# Altium schematic sheet carrier.SchDoc: Carrier
size A3; Organization: GPA Robotics; DocumentNumber: 2; Revision: REV 0; SheetNumber: 2; SheetTotal: 11
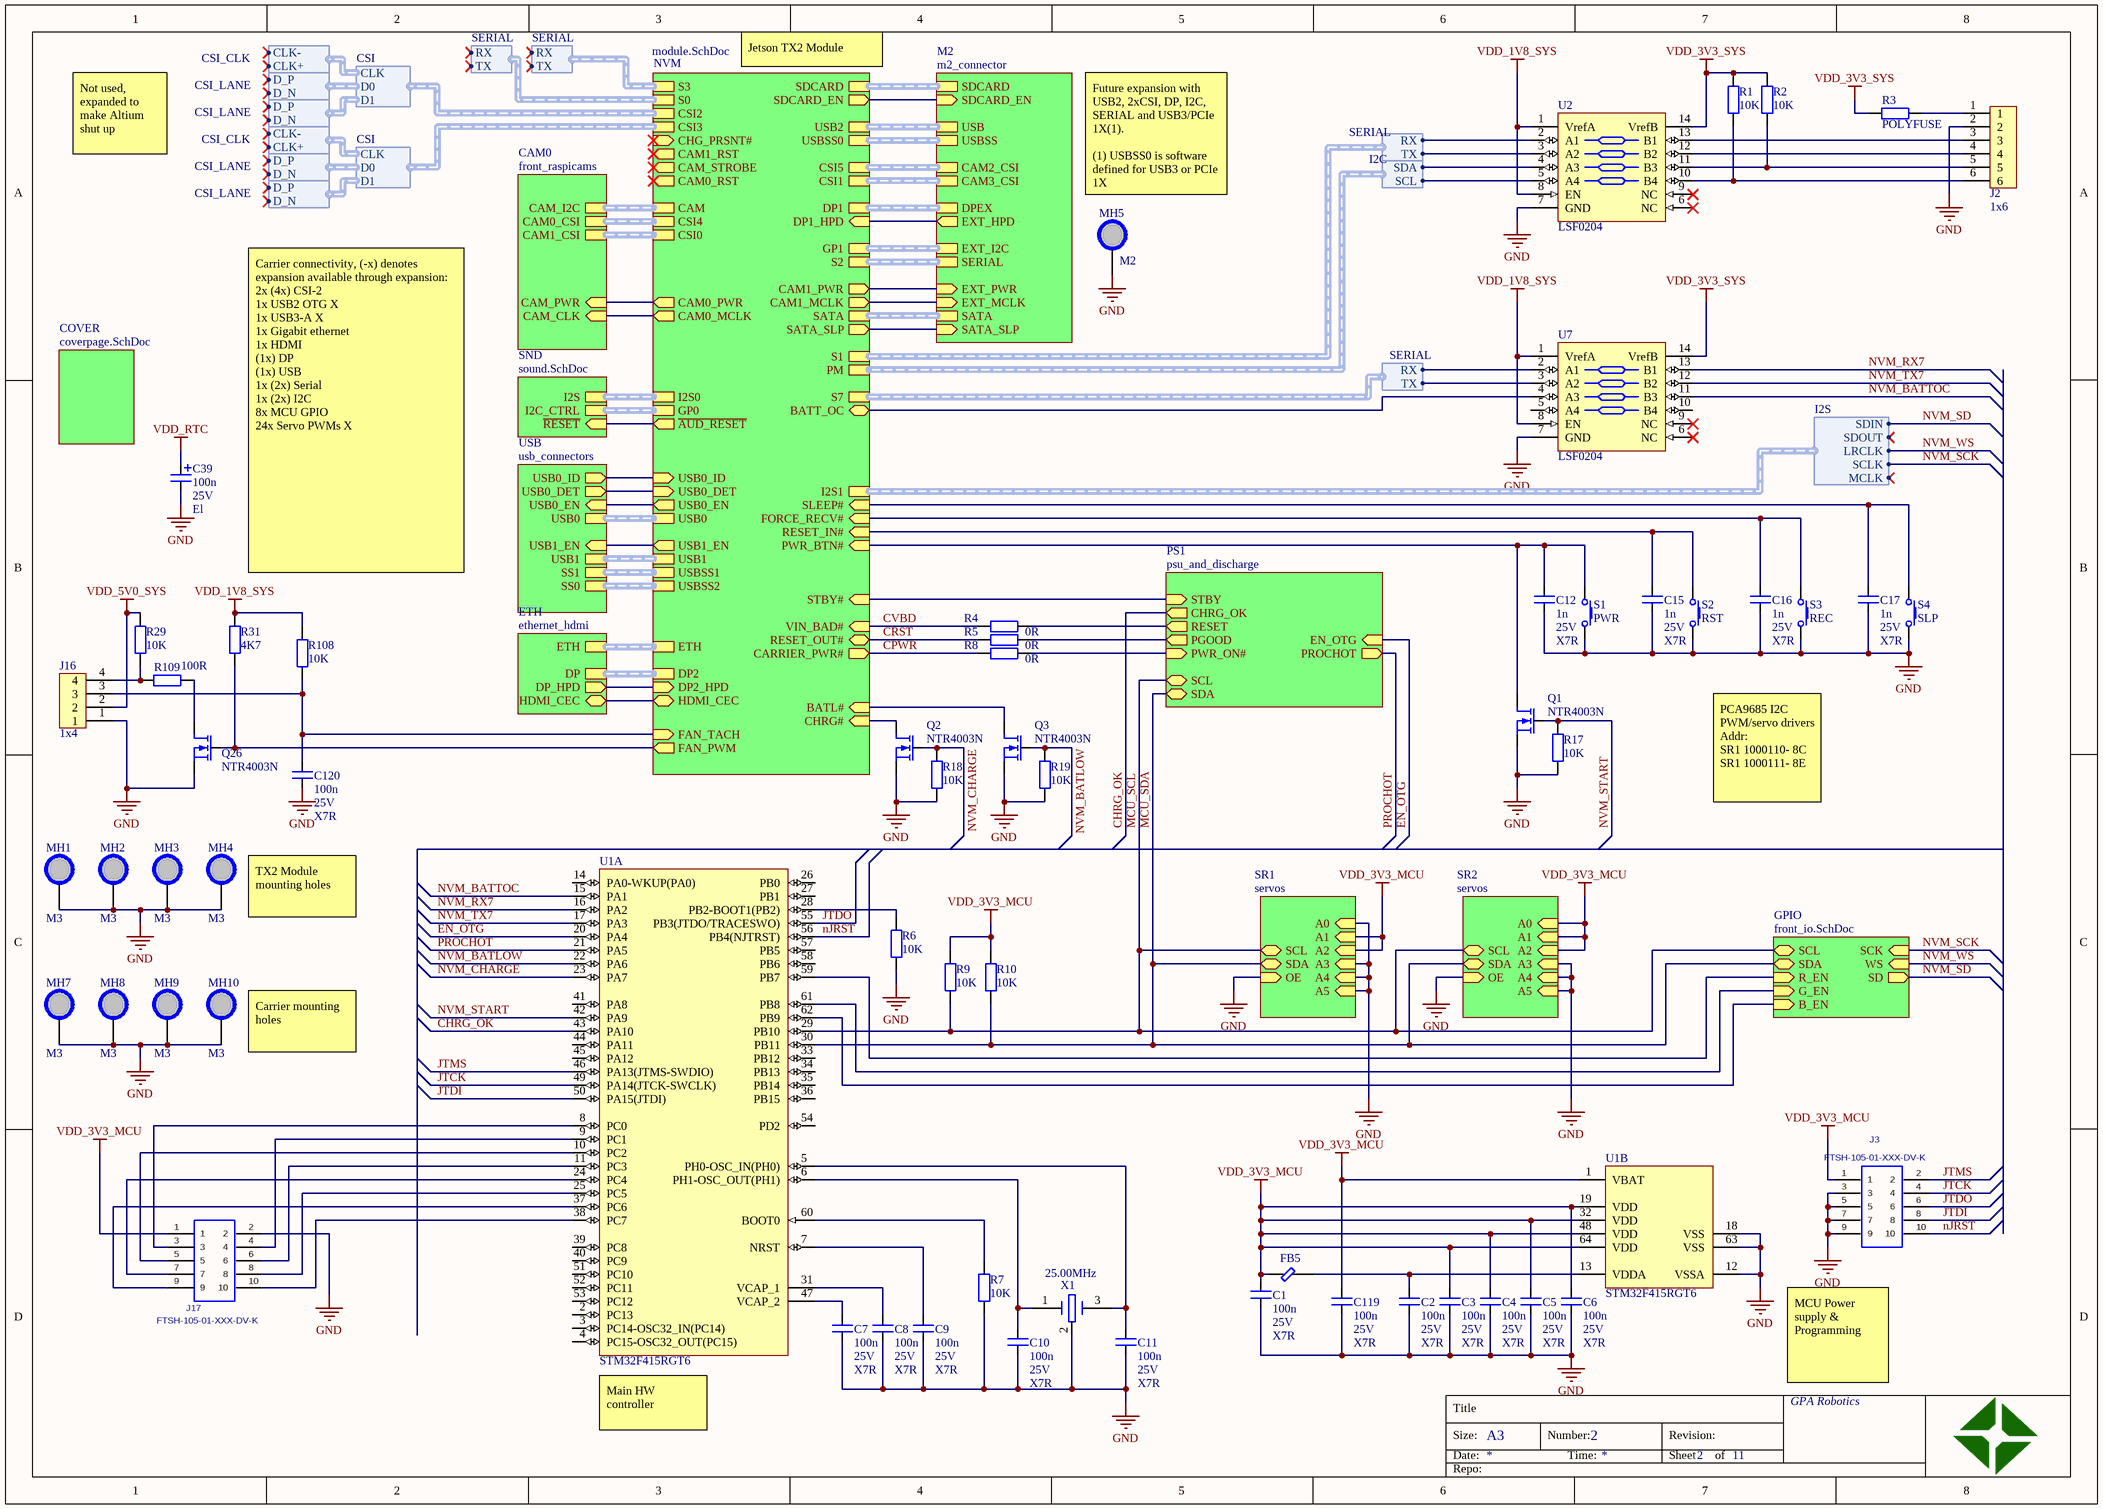
[diagram p0: carrier.SchDoc]

## Parts
C1  value 100n  Voltage: 25V  Type: X7R  [C1005[0402]]  (hidden comment: cap)
C2  value 100n  Voltage: 25V  Type: X7R  [C1005[0402]]  (hidden comment: cap)
C3  value 100n  Voltage: 25V  Type: X7R  [C1005[0402]]  (hidden comment: cap)
C4  value 100n  Voltage: 25V  Type: X7R  [C1005[0402]]  (hidden comment: cap)
C5  value 100n  Voltage: 25V  Type: X7R  [C1005[0402]]  (hidden comment: cap)
C6  value 100n  Voltage: 25V  Type: X7R  [C1005[0402]]  (hidden comment: cap)
C7  value 100n  Voltage: 25V  Type: X7R  [C1005[0402]]  (hidden comment: cap)
C8  value 100n  Voltage: 25V  Type: X7R  [C1005[0402]]  (hidden comment: cap)
C9  value 100n  Voltage: 25V  Type: X7R  [C1005[0402]]  (hidden comment: cap)
C10  value 100n  Voltage: 25V  Type: X7R  [C1005[0402]]  (hidden comment: cap)
C11  value 100n  Voltage: 25V  Type: X7R  [C1005[0402]]  (hidden comment: cap)
C12  value 1n  Voltage: 25V  Type: X7R  [C1005[0402]]  (hidden comment: cap)
C15  value 1n  Voltage: 25V  Type: X7R  [C1005[0402]]  (hidden comment: cap)
C16  value 1n  Voltage: 25V  Type: X7R  [C1005[0402]]  (hidden comment: cap)
C17  value 1n  Voltage: 25V  Type: X7R  [C1005[0402]]  (hidden comment: cap)
C39  value 100n  Voltage: 25V  Type: El  [SC_DSK-3R3H224U-HL]  (hidden comment: pcap)
C119  value 100n  Voltage: 25V  Type: X7R  [C1005[0402]]  (hidden comment: cap)
C120  value 100n  Voltage: 25V  Type: X7R  [C1005[0402]]  (hidden comment: cap)
FB5  2506036007Y3  [FBC1608X07N]  (value not drawn)
J2  1x6  [hdr_100mil_1x6]
J3  FTSH-105-01-XXX-DV-K  [FTSH-105-01-XXX-DV-K]
J16  1x4  [molex_picoblade_1x4]
J17  FTSH-105-01-XXX-DV-K  [FTSH-105-01-XXX-DV-K]
MH1  M3  [m3_pan_tight_round]
MH2  M3  [m3_pan_tight_round]
MH3  M3  [m3_pan_tight_round]
MH4  M3  [m3_pan_tight_round]
MH5  M2  [m2_pan_tight_round]
MH7  M3  [m3_pan_tight_round]
MH8  M3  [m3_pan_tight_round]
MH9  M3  [m3_pan_tight_round]
MH10  M3  [m3_pan_tight_round]
Q1  NTR4003N  [NCH_SOT95P237X110-3N]
Q2  NTR4003N  [NCH_SOT95P237X110-3N]
Q3  NTR4003N  [NCH_SOT95P237X110-3N]
Q26  NTR4003N  [NCH_SOT95P237X110-3N]
R1  value 10K  [R1005[0402]]  (hidden comment: res)
R2  value 10K  [R1005[0402]]  (hidden comment: res)
R3  value POLYFUSE  [R1005[0402]]  (hidden comment: res)
R4  value 0R  [R1005[0402]]  (hidden comment: res)
R5  value 0R  [R1005[0402]]  (hidden comment: res)
R6  value 10K  [R1005[0402]]  (hidden comment: res)
R7  value 10K  [R1005[0402]]  (hidden comment: res)
R8  value 0R  [R1005[0402]]  (hidden comment: res)
R9  value 10K  [R1005[0402]]  (hidden comment: res)
R10  value 10K  [R1005[0402]]  (hidden comment: res)
R17  value 10K  [R1005[0402]]  (hidden comment: res)
R18  value 10K  [R1005[0402]]  (hidden comment: res)
R19  value 10K  [R1005[0402]]  (hidden comment: res)
R29  value 10K  [R1005[0402]]  (hidden comment: res)
R31  value 4K7  [R1005[0402]]  (hidden comment: res)
R108  value 10K  [R1005[0402]]  (hidden comment: res)
R109  value 100R  [R1005[0402]]  (hidden comment: res)
S1  PWR  [SW_6MM_TACT]
S2  RST  [SW_6MM_TACT]
S3  REC  [SW_6MM_TACT]
S4  SLP  [SW_6MM_TACT]
U1  STM32F415RGT6  [STM-LQFP64_N]  (parts A,B of 2)
U2  LSF0204  [TI_TSOP65P640X120-14N]
U7  LSF0204  [TI_TSOP65P640X120-14N]
X1  value 25.00MHz  [FA-238]  (hidden comment: crystal_shielded)

## Sub-sheets
CAM0 = front_raspicams: CAM0_CSI (harness CSI), CAM_I2C (harness I2C), CAM_CLK (in), CAM_PWR (in), CAM1_CSI (harness CSI)
COVER = coverpage.SchDoc: no entries
ETH = ethernet_hdmi: ETH (harness GBE), DP (harness DP), DP_HPD (out), HDMI_CEC (bidir)
GPIO = front_io.SchDoc: SCL (bidir), SDA (bidir), WS (in), SCK (in), R_EN (in), G_EN (in), SD (out), B_EN (in)
M2 = m2_connector: SDCARD_EN (in), SDCARD (harness SDCARD), USB (harness USB2), USBSS (harness USB3), CAM2_CSI (harness CSI), CAM3_CSI (harness CSI), DPEX (harness DP), EXT_HPD (out), EXT_I2C (harness I2C), SERIAL (harness SERIAL), EXT_PWR (in), EXT_MCLK (in), SATA_SLP (in), SATA (harness SATA)
NVM = module.SchDoc: CHRG# (in), CSI5 (harness CSI), CSI0 (harness CSI), CSI4 (harness CSI), USB0 (harness USB2), CAM (harness I2C), USB0_ID (in), CSI3 (harness CSI), BATL# (in), PM (harness I2C), CSI2 (harness CSI), STBY# (in), CSI1 (harness CSI), GP1 (harness I2C), CAM_STROBE (out), SDCARD (harness SDCARD), CAM1_MCLK (out), CAM0_MCLK (out), S7 (harness SERIAL), CAM0_PWR (out), GP0 (harness I2C), SDCARD_EN (out), USB0_EN (out), PWR_BTN# (in), S3 (harness SERIAL), S2 (harness SERIAL), S1 (harness SERIAL), SLEEP# (in), CAM0_RST (out), CAM1_PWR (out), S0 (harness SERIAL), FORCE_RECV# (in), CAM1_RST (out), USB1_EN (out), USB0_DET (in), USBSS0 (harness USB3), CHG_PRSNT# (in), CARRIER_PWR# (out), RESET_IN# (in), USBSS2 (harness USB3), USBSS1 (harness USB3), VIN_BAD# (in), USB1 (harness USB2), RESET_OUT# (bidir), ETH (harness GBE), USB2 (harness USB2), DP1 (harness DP), DP1_HPD (in), DP2 (harness DP), DP2_HPD (in), I2S0 (harness I2S), BATT_OC (bidir), ~{AUD_RESET} (out), SATA (harness SATA), SATA_SLP (out), I2S1 (harness I2S), FAN_PWM (out), FAN_TACH (in), HDMI_CEC (bidir)
PS1 = psu_and_discharge: SCL (bidir), PWR_ON# (in), PGOOD (out), SDA (bidir), RESET (out), EN_OTG (in), PROCHOT (out), CHRG_OK (out), STBY (in)
SND = sound.SchDoc: ~{RESET} (in), I2S (harness I2S), I2C_CTRL (harness I2C)
SR1 = servos: SDA (bidir), SCL (bidir), OE (in), A1 (in), A2 (in), A3 (in), A0 (in), A4 (in), A5 (in)
SR2 = servos: SDA (bidir), SCL (bidir), OE (in), A1 (in), A2 (in), A3 (in), A0 (in), A4 (in), A5 (in)
USB = usb_connectors: USB0 (harness USB2), USB1 (harness USB2), SS1 (harness USB3), USB0_DET (out), USB0_EN (in), USB0_ID (out), USB1_EN (in), SS0 (harness USB3)

## Harnesses
SERIAL: RX, TX
I2C: SDA, SCL
I2S: SDIN, SDOUT, LRCLK, SCLK, MCLK
CSI: CLK, D0, D1
CSI_CLK: CLK-, CLK+
CSI_LANE: D_P, D_N

## Nets
GND: C1.2 C2.2 C3.2 C4.2 C5.2 C6.2 C7.2 C8.2 C9.2 C10.2 C11.2 C12.1 C15.1 C16.1 C17.1 C39.2 C119.2 C120.1 J2.2 J3.3 J3.5 J3.7 J3.9 J16.1 J17.2 MH1.1 MH2.1 MH3.1 MH4.1 MH5.1 MH7.1 MH8.1 MH9.1 MH10.1 Q1.S Q2.S Q3.S Q26.S R6.1 R7.1 R17.1 R18.1 R19.1 S1.2 S2.2 S3.2 S4.2 U1.12(VSSA) U1.18(VSS) U1.63(VSS) U2.7(GND) U7.7(GND) X1.2 ; sheet SR1/OE, sheet SR1/A3, sheet SR1/A0, sheet SR1/A4, sheet SR1/A5, sheet SR2/OE, sheet SR2/A3, sheet SR2/A4, sheet SR2/A5
VDD_1V8_SYS: R31.2 R108.2 U2.1(VrefA) U2.8(EN) U7.1(VrefA) U7.8(EN)
VDD_3V3_MCU: C1.1 C3.1 C4.1 C5.1 C6.1 C119.1 FB5.1 J3.1 J17.1 R9.2 R10.2 U1.1(VBAT) U1.19(VDD) U1.32(VDD) U1.48(VDD) U1.64(VDD) ; sheet SR1/A1, sheet SR1/A2, sheet SR2/A1, sheet SR2/A2, sheet SR2/A0
VDD_3V3_SYS: R1.2 R2.2 R3.2 U2.14(VrefB) U7.14(VrefB)
VDD_5V0_SYS: J16.2 R29.1
VDD_RTC: C39.1
CHRG_OK: U1.43(PA10) ; sheet PS1/CHRG_OK
CPWR: R8.1 ; sheet NVM/CARRIER_PWR#
CRST: R5.1 ; sheet NVM/RESET_OUT#
CVBD: R4.1 ; sheet NVM/VIN_BAD#
EN_OTG: U1.20(PA4) ; sheet PS1/EN_OTG
JTCK: J3.4 U1.49(PA14(JTCK-SWCLK))
JTDI: J3.8 U1.50(PA15(JTDI))
JTDO: J3.6 U1.55(PB3(JTDO/TRACESWO))
JTMS: J3.2 U1.46(PA13(JTMS-SWDIO))
MCU_SCL: R9.1 U1.29(PB10) ; sheet SR1/SCL, sheet SR2/SCL, sheet PS1/SCL, sheet GPIO/SCL
MCU_SDA: R10.1 U1.30(PB11) ; sheet SR1/SDA, sheet SR2/SDA, sheet PS1/SDA, sheet GPIO/SDA
nJRST: J3.10 U1.56(PB4(NJTRST))
NVM_BATLOW: Q3.G R19.2 U1.22(PA6)
NVM_BATTOC: U1.15(PA1) U7.11(B3)
NVM_CHARGE: Q2.G R18.2 U1.23(PA7)
NVM_RX7: U1.16(PA2) U7.13(B1)
NVM_SCK: sheet GPIO/SCK, sheet NVM/I2S1.SCLK
NVM_SD: sheet GPIO/SD, sheet NVM/I2S1.SDIN
NVM_START: Q1.G R17.2 U1.42(PA9)
NVM_TX7: U1.17(PA3) U7.12(B2)
NVM_WS: sheet GPIO/WS, sheet NVM/I2S1.LRCLK
PROCHOT: U1.21(PA5) ; sheet PS1/PROCHOT
NetC2_1: C2.1 FB5.2 U1.13(VDDA)
NetC7_1: C7.1 U1.47(VCAP_2)
NetC8_1: C8.1 U1.31(VCAP_1)
NetC9_1: C9.1 U1.7(NRST)
NetC10_1: C10.1 U1.6(PH1-OSC_OUT(PH1)) X1.1
NetC11_1: C11.1 U1.5(PH0-OSC_IN(PH0)) X1.3
NetC12_2: C12.2 Q1.D S1.1 ; sheet NVM/PWR_BTN#
NetC15_2: C15.2 S2.1 ; sheet NVM/RESET_IN#
NetC16_2: C16.2 S3.1 ; sheet NVM/FORCE_RECV#
NetC17_2: C17.2 S4.1 ; sheet NVM/SLEEP#
NetC120_2: C120.2 J16.3 R108.1 ; sheet NVM/FAN_TACH
NetJ2_1: J2.1 R3.1
NetJ2_3: J2.3 U2.13(B1)
NetJ2_4: J2.4 U2.12(B2)
NetJ2_5: J2.5 R2.1 U2.11(B3)
NetJ2_6: J2.6 R1.1 U2.10(B4)
NetJ16_4: J16.4 R29.2 R109.1
NetJ17_3: J17.3 U1.8(PC0)
NetJ17_4: J17.4 U1.9(PC1)
NetJ17_5: J17.5 U1.10(PC2)
NetJ17_6: J17.6 U1.11(PC3)
NetJ17_7: J17.7 U1.24(PC4)
NetJ17_8: J17.8 U1.25(PC5)
NetJ17_9: J17.9 U1.37(PC6)
NetJ17_10: J17.10 U1.38(PC7)
NetQ2_D: Q2.D ; sheet NVM/CHRG#
NetQ3_D: Q3.D ; sheet NVM/BATL#
NetQ26_D: Q26.D R109.2
NetQ26_G: Q26.G R31.1 ; sheet NVM/FAN_PWM
NetR4_2: R4.2 ; sheet PS1/RESET
NetR5_2: R5.2 ; sheet PS1/PGOOD
NetR6_2: R6.2 U1.28(PB2-BOOT1(PB2))
NetR7_2: R7.2 U1.60(BOOT0)
NetR8_2: R8.2 ; sheet PS1/PWR_ON#
NetU1_59: U1.59(PB7) ; sheet GPIO/R_EN
NetU1_61: U1.61(PB8) ; sheet GPIO/G_EN
NetU1_62: U1.62(PB9) ; sheet GPIO/B_EN
NetU2_2: U2.2(A1) ; sheet NVM/S1.RX
NetU2_3: U2.3(A2) ; sheet NVM/S1.TX
NetU2_4: U2.4(A3) ; sheet NVM/PM.SDA
NetU2_5: U2.5(A4) ; sheet NVM/PM.SCL
NetU7_2: U7.2(A1) ; sheet NVM/S7.RX
NetU7_3: U7.3(A2) ; sheet NVM/S7.TX
NetU7_4: U7.4(A3) ; sheet NVM/BATT_OC
(unnamed): sheet NVM/USB0_ID, sheet USB/USB0_ID
(unnamed): sheet NVM/STBY#, sheet PS1/STBY
(unnamed): sheet NVM/CAM1_MCLK, sheet M2/EXT_MCLK
(unnamed): sheet NVM/CAM0_MCLK, sheet CAM0/CAM_CLK
(unnamed): sheet NVM/CAM0_PWR, sheet CAM0/CAM_PWR
(unnamed): sheet NVM/SDCARD_EN, sheet M2/SDCARD_EN
(unnamed): sheet NVM/USB0_EN, sheet USB/USB0_EN
(unnamed): sheet NVM/CAM1_PWR, sheet M2/EXT_PWR
(unnamed): sheet NVM/USB1_EN, sheet USB/USB1_EN
(unnamed): sheet NVM/USB0_DET, sheet USB/USB0_DET
(unnamed): sheet NVM/DP1_HPD, sheet M2/EXT_HPD
(unnamed): sheet NVM/DP2_HPD, sheet ETH/DP_HPD
(unnamed): sheet NVM/~{AUD_RESET}, sheet SND/~{RESET}
(unnamed): sheet NVM/SATA_SLP, sheet M2/SATA_SLP
(unnamed): sheet NVM/HDMI_CEC, sheet ETH/HDMI_CEC

Not connected (* = marked no-connect by the designer): U1 2(PC13) 3(PC14-OSC32_IN(PC14)) 4(PC15-OSC32_OUT(PC15)) 14(PA0-WKUP(PA0)) 26(PB0) 27(PB1) 33(PB12) 34(PB13) 35(PB14) 36(PB15) 39(PC8) 40(PC9) 41(PA8) 44(PA11) 45(PA12) 51(PC10) 52(PC11) 53(PC12) 54(PD2) 57(PB5) 58(PB6); U2 6(NC)* 9(NC)*; U7 5(A4) 6(NC)* 9(NC)* 10(B4)

## Buses and harness runs
harness sheet CAM0/CAM0_CSI = sheet NVM/CSI4
harness sheet CAM0/CAM1_CSI = sheet NVM/CSI0
harness sheet CAM0/CAM_I2C = sheet NVM/CAM
harness sheet ETH/DP = sheet NVM/DP2
harness sheet ETH/ETH = sheet NVM/ETH
harness sheet M2/CAM2_CSI = sheet NVM/CSI5
harness sheet M2/CAM3_CSI = sheet NVM/CSI1
harness sheet M2/DPEX = sheet NVM/DP1
harness sheet M2/EXT_I2C = sheet NVM/GP1
harness sheet M2/SATA = sheet NVM/SATA
harness sheet M2/SDCARD = sheet NVM/SDCARD
harness sheet M2/SERIAL = sheet NVM/S2
harness sheet M2/USB = sheet NVM/USB2
harness sheet M2/USBSS = sheet NVM/USBSS0
harness sheet NVM/GP0 = sheet SND/I2C_CTRL
harness sheet NVM/I2S0 = sheet SND/I2S
harness sheet NVM/USB0 = sheet USB/USB0
harness sheet NVM/USB1 = sheet USB/USB1
harness sheet NVM/USBSS1 = sheet USB/SS1
harness sheet NVM/USBSS2 = sheet USB/SS0

## Notes on the sheet
- Jetson TX2 Module
- Not used, expanded to make Altium shut up
- Future expansion with USB2, 2xCSI, DP, I2C, SERIAL and USB3/PCIe 1X(1).
  (1) USBSS0 is software defined for USB3 or PCIe 1X
- Carrier connectivity, (-x) denotes expansion available through expansion:
  2x (4x) CSI-2
  1x USB2 OTG X
  1x USB3-A X
  1x Gigabit ethernet
  1x HDMI
  (1x) DP
  (1x) USB
  1x (2x) Serial
  1x (2x) I2C
  8x MCU GPIO
  24x Servo PWMs X
- PCA9685 I2C PWM/servo drivers
  Addr:
  SR1 1000110- 8C
  SR1 1000111- 8E
- (near MH4) TX2 Module mounting holes
- (near MH10) Carrier mounting holes
- MCU Power supply & Programming
- (near U1) Main HW controller
- Title
- Size:
- Date:
- A3
- Number:
- Time:
- Revision:
- Sheet
- of
- Repo:

## Library data of the parts
C1-C12 C15-C17 C119 C120 = cap: Capacitor; Manufacturer: *; Series: *
C39 = pcap: Polarized capacitor; Manufacturer: *; Series: *
FB5 = ferrite_bead: Ferrite bead
J2 = header_1x6
J3 J17 = FTSH-105-01-XXX-DV-K: TERMINAL STRIP, .050"(1.27mm) PITCH, 10 PINS, KEYED; MANUFACTURER: SAMTEC; CREATED: November 30, 2016 - Wendy Xin; PCB DECAL: FTSH-105-01-XXX-DV-K
J16 = header_1x4
MH1-MH5 MH7-MH10 = mounting_hole
Q1-Q3 Q26 = nch_mosfet
R1-R10 R17-R19 = res: Resistor
R29 R31 R108 R109 = res: Resistor; Tolerance: 5%
S1-S4 = btn
  S1: Text: PWR
  S2: Text: RST
  S3: Text: REC
  S4: Text: SLP
U1 = STM32F415RGT6: ARM Cortex-M4 32-bit MCU+FPU, 210 DMIPS, 1024 kB Flash, 192 kB Internal RAM, 51 I/Os, 64-pin LQFP, -40 to 85 degC, Tray; Manufacturer: STMicroelectronics; D/A Converter: 2x12-bit; FLASH Size (Prog) (kB): 1024; I/Os (High Current): 51; Internal RAM Size (kB): 192; Operating Frequency(F) (Processor speed) (MHz): 168; Supply Voltage(Vcc) max (V): 3.6; Supply Voltage(Vcc) min (V): 1.8; DatasheetVersion: Rev. 4; PackageVersion: Rev. 4, 06/2013; PackageReference: LQFP64; PackageDescription: 64-Pin Low Profile Quad Flat Package, 10 x 10 mm Body, 0.5 mm Pitch; Supplier 1: Digi-Key; Supplier Part Number 1: 497-11907-ND; Supplier 2: Farnell; Supplier Part Number 2: 2064370; Supplier 3: Newark; Supplier Part Number 3: 73T2335; Supplier 4: Mouser; Supplier Part Number 4: 511-STM32F415RGT6; Core: ARM Cortex-M4; Packing: Tray; Mounting Technology: Surface Mount; PartNumber: STM32F415RGT6; ComponentLink1Description: Manufacturer URL; ComponentLink1URL: http://www.st.com/web/en/home.html; ComponentLink2Description: Datasheet; ComponentLink2URL: http://www.st.com/st-web-ui/static/active/en/resource/technical/document/datasheet/DM00035129.pdf; ComponentLink3Description: Package Specification; ComponentLink3URL: http://www.st.com/st-web-ui/static/active/en/resource/technical/document/datasheet/DM00037051.pdf
X1 = crystal_shielded: Crystal with shield